# EAGLE design ReceiverV2 (EAGLE 9.2.1)
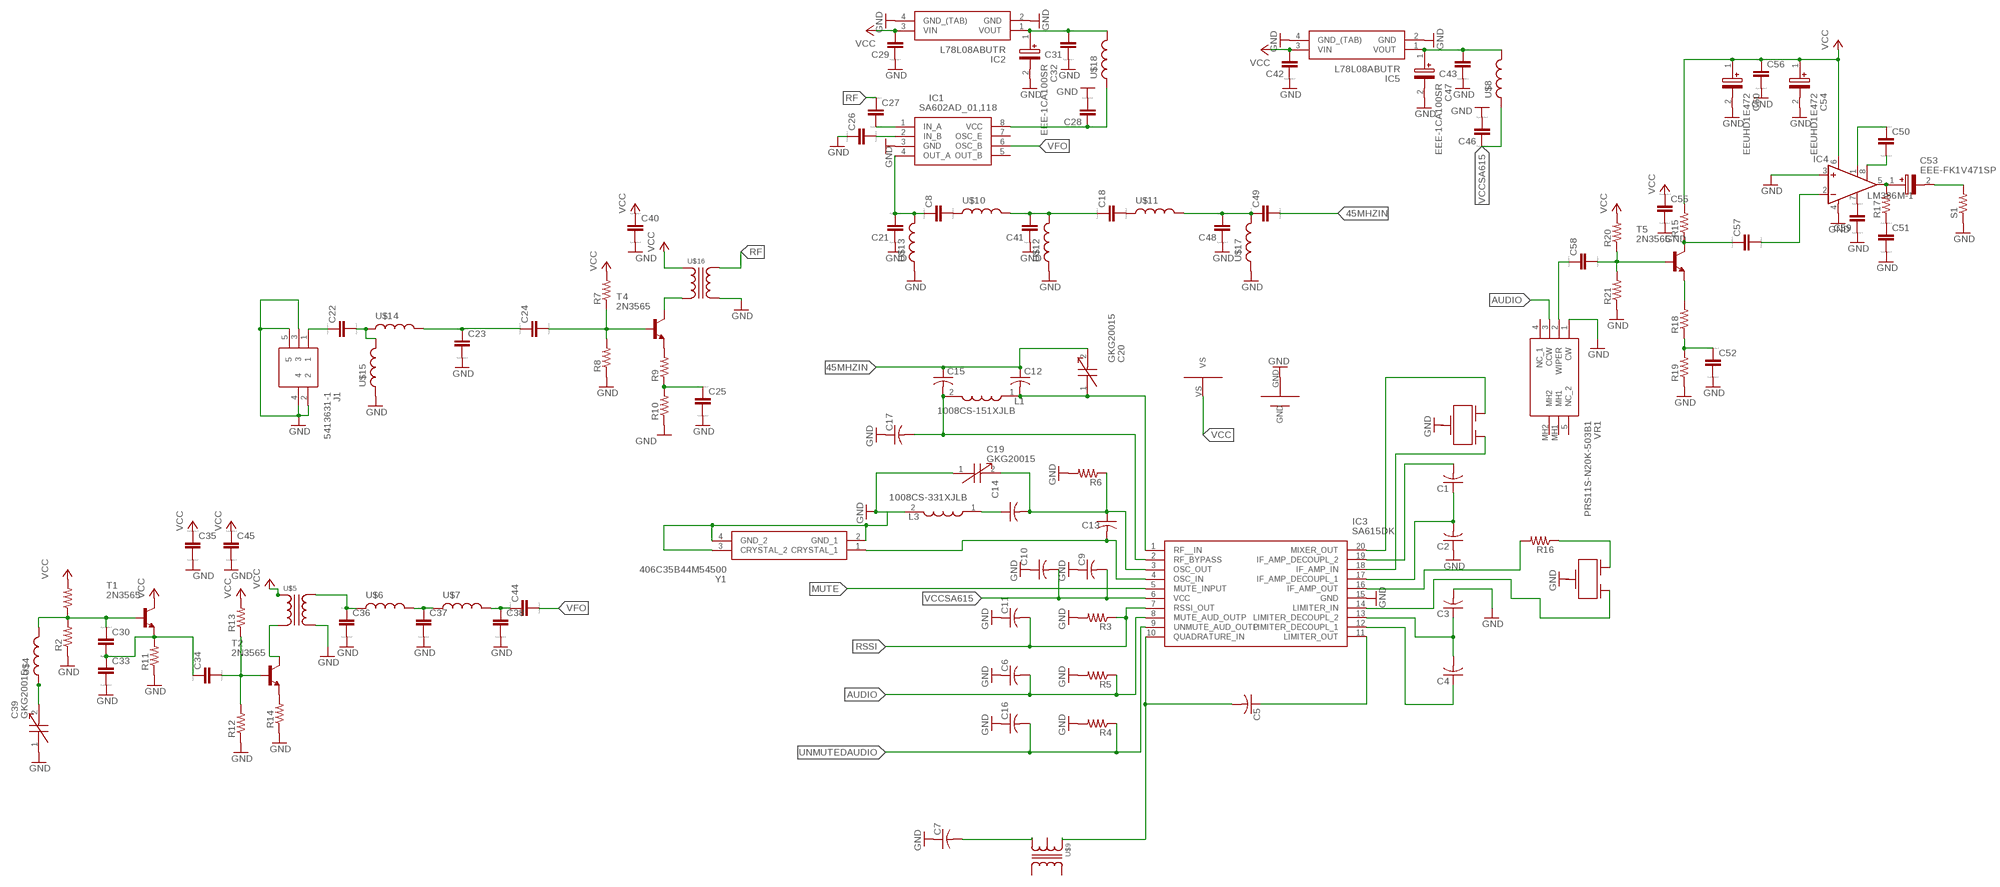
[diagram p0: schematic, sheet 1]

## Parts
C1  C-USC0805  [C0805]
C2  C-USC0805  [C0805]
C3  C-USC0805  [C0805]
C4  C-USC0805  [C0805]
C5  C-USC0805  [C0805]
C6  C-USC0805  [C0805]
C7  C-USC0805  [C0805]
C8  C  [C0805]
C9  C-USC0805  [C0805]
C10  C-USC0805  [C0805]
C11  C-USC0805  [C0805]
C12  C-USC0805  [C0805]
C13  C-USC0805  [C0805]
C14  C-USC0805  [C0805]
C15  C-USC0805  [C0805]
C16  C-USC0805  [C0805]
C17  C-USC0805  [C0805]
C18  C  [C0805]
C19  GKG20015  [GKG20015]
C20  GKG20015  [GKG20015]
C21  C  [C0805]
C22  C  [C0805]
C23  C  [C0805]
C24  C  [C0805]
C25  C  [C0805]
C26  C  [C0805]
C27  C  [C0805]
C28  C  [C0805]
C29  C  [C0805]
C30  C  [C0805]
C31  C  [C0805]
C32  EEE-1CA100SR  [SV(B)]
C33  C  [C0805]
C34  C  [C0805]
C35  C  [C0805]
C36  C  [C0805]
C37  C  [C0805]
C38  C  [C0805]
C39  GKG20015  [GKG20015]
C40  C  [C0805]
C41  C  [C0805]
C42  C  [C0805]
C43  C  [C0805]
C44  C  [C0805]
C45  C  [C0805]
C46  C  [C0805]
C47  EEE-1CA100SR  [SV(B)]
C48  C  [C0805]
C49  C  [C0805]
C50  C  [C0805]
C51  C  [C0805]
C52  C  [C0805]
C53  EEE-FK1V471SP  [CAPAE1030X1050N]
C54  EEUHD1E472  [CAPPRD750W85D1600H2700]
C55  C  [C0805]
C56  CC1206  [C1206]
C57  C  [C0805]
C58  C  [C0805]
C59  C  [C0805]
C60  EEUHD1E472  [CAPPRD750W85D1600H2700]
IC1  SA602AD_01,118  [SOIC127P600X175-8N]
IC2  L78L08ABUTR  [ST-SOT-89]
IC3  SA615DK  [SOP65P640X150-20N]
IC4  LM386M-1  [SO08]
IC5  L78L08ABUTR  [ST-SOT-89]
J1  5413631-1  [54136311]
L1  1008CS-151XJLB  [INDC2928X203N]
L3  1008CS-331XJLB  [INDC2928X203N]
R1  R-US_R0805  [R0805]
R2  R-US_R0805  [R0805]
R3  R-US_R0805  [R0805]
R4  R-US_R0805  [R0805]
R5  R-US_R0805  [R0805]
R6  R-US_R0805  [R0805]
R7  R-US_R0805  [R0805]
R8  R-US_R0805  [R0805]
R9  R-US_R0805  [R0805]
R10  R-US_R0805  [R0805]
R11  R-US_R0805  [R0805]
R12  R-US_R0805  [R0805]
R13  R-US_R0805  [R0805]
R14  R-US_R0805  [R0805]
R15  R-US_R0805  [R0805]
R16  R-US_R0805  [R0805]
R17  R-US_R0805  [R0805]
R18  R-US_R0805  [R0805]
R19  R-US_R0805  [R0805]
R20  R-US_R0805  [R0805]
R21  R-US_R0805  [R0805]
S1  R-US_0207/5V  [0207/5V]
T1  2N3565  [TO92]
T2  2N3565  [TO92]
T4  2N3565  [TO92]
T5  2N3565  [TO92]
U$1  ALLIGATORCLIPS  [ALLIGATORCONNECTOR]
U$2  CFWLB455KGFA-B0  [CFWLB455KGFA-B0]
U$4  WOUNDINDUCTOR  [WOUNDINDUCTOR]
U$5  RFTRANSFORMER  [RFTRABSFORMER]
U$6  WOUNDINDUCTOR  [WOUNDINDUCTOR]
U$7  WOUNDINDUCTOR  [WOUNDINDUCTOR]
U$8  WOUNDINDUCTOR  [WOUNDINDUCTOR]
U$9  42IF123  [42IF123]
U$10  WOUNDINDUCTOR  [WOUNDINDUCTOR]
U$11  WOUNDINDUCTOR  [WOUNDINDUCTOR]
U$12  WOUNDINDUCTOR  [WOUNDINDUCTOR]
U$13  WOUNDINDUCTOR  [WOUNDINDUCTOR]
U$14  WOUNDINDUCTOR  [WOUNDINDUCTOR]
U$15  WOUNDINDUCTOR  [WOUNDINDUCTOR]
U$16  RFTRANSFORMER  [RFTRABSFORMER]
U$17  WOUNDINDUCTOR  [WOUNDINDUCTOR]
U$18  WOUNDINDUCTOR  [WOUNDINDUCTOR]
U$19  CFWLB455KGFA-B0  [CFWLB455KGFA-B0]
VR1  PRS11S-N20K-503B1  [PRS11SN20K503B1]
Y1  406C35B44M54500  [406C35B44M54500]

## Nets
45MHZIN: C12.1 C15.1 C20.2 C49.2
AUDIO: C6.2 IC3.8(MUTE_AUD_OUTP) R5.1 VR1.3(CCW)
GND: C2.1 C3.2 C6.1 C7.1 C9.1 C10.1 C11.1 C16.1 C17.1 C19.1 C21.1 C23.2 C25.2 C26.1 C28.2 C29.1 C31.1 C32.2(-) C33.2 C35.2 C36.2 C37.2 C38.2 C39.1 C40.2 C41.1 C42.1 C43.1 C45.2 C46.2 C47.2(-) C48.1 C51.2 C52.2 C54.2(-) C55.2 C56.2 C59.1 C60.2(-) IC1.3(GND) IC2.2(GND) IC2.4(GND_(TAB)) IC3.15(GND) IC4.3(+IN) IC4.4(GND) IC5.2(GND) IC5.4(GND_(TAB)) J1.2 J1.3 J1.4 J1.5 L3.2 R2.1 R3.2 R4.2 R5.2 R6.2 R8.1 R10.1 R11.1 R12.1 R14.1 R19.1 R21.1 S1.1 U$1.GND U$5.P$4 U$12.1 U$13.1 U$15.1 U$16.P$4 U$17.1 VR1.1(CW) Y1.2(GND_1) Y1.3(CRYSTAL_2) Y1.4(GND_2)
MUTE: IC3.5(MUTE_INPUT)
N$1: C25.1 R9.1 R10.2
N$2: C22.1 J1.1
N$3: C23.1 C24.1 U$14.2
N$5: C5.2 IC3.10(QUADRATURE_IN) U$9.P$2
N$6: C14.1 L3.1
N$7: C5.1 IC3.11(LIMITER_OUT)
N$8: C4.1 IC3.12(LIMITER_DECOUPL_1)
N$9: C3.1 C4.2 IC3.13(LIMITER_DECOUPL_2)
N$10: C7.2 U$9.P$3
N$11: IC3.14(LIMITER_IN) U$2.P$4(OUT)
N$12 [Small]: C15.2 C17.2 IC3.2(RF_BYPASS) L1.2
N$13: C13.2 IC3.4(OSC_IN) Y1.1(CRYSTAL_1)
N$14 [Small]: C13.1 C14.2 C19.2 IC3.3(OSC_OUT) R6.1
N$15: IC3.16(IF_AMP_OUT) R16.2
N$16 [Small]: C12.2 C20.1 IC3.1(RF__IN) L1.1
N$17: C57.2 IC4.2(-IN)
N$18: C1.1 C2.2 IC3.17(IF_AMP_DECOUPL_1)
N$19: IC3.18(IF_AMP_IN) U$19.P$4(OUT)
N$20: IC3.20(MIXER_OUT) U$19.P$1(IN)
N$21: C1.2 IC3.19(IF_AMP_DECOUPL_2)
N$22: C24.2 R7.1 R8.2 T4.2(B)
N$23: R9.2 T4.3(E)
N$24: T4.1(C) U$16.P$1
N$25: C26.2 IC1.2(IN_B)
N$26: C27.2 IC1.1(IN_A)
N$27: C8.2 U$10.1
N$28: C8.1 C21.2 IC1.4(OUT_A) U$13.2
N$29: R14.2 T2.3(E)
N$30: C30.2 C33.1 C34.1 R11.2 T1.3(E)
N$31: C30.1 R1.1 R2.2 T1.2(B) U$4.2
N$32: C34.2 R12.2 R13.1 T2.2(B)
N$33: C39.2 U$4.1
N$34: C28.1 IC1.8(VCC) U$18.1
N$35: C36.1 U$5.P$3 U$6.1
N$36: C22.2 U$14.1 U$15.2
N$37: C37.1 U$6.2 U$7.1
N$38: C38.1 C44.1 U$7.2
N$39: T2.1(C) U$5.P$1
N$40: C18.2 U$11.1
N$41: C18.1 C41.2 U$10.2 U$12.2
N$42: C43.2 C47.1(+) IC5.1(VOUT) U$8.2
N$43: C48.2 C49.1 U$11.2 U$17.2
N$44: C58.1 VR1.2(WIPER)
N$45: C53.1(+) IC4.5(OUT) R17.2
N$46: C51.1 R17.1
N$47: C31.2 C32.1(+) IC2.1(VOUT) U$18.2
N$48: C50.1 IC4.1(GAIN)
N$49: C50.2 IC4.8(GAIN)
N$50: C53.2(-) S1.2
N$51: C58.2 R20.1 R21.2 T5.2(B)
N$52: R18.2 T5.3(E)
N$53: C52.1 R18.1 R19.2
N$54: C57.1 R15.1 T5.1(C)
N$55: C59.2 IC4.7(BYPASS)
N$56: R16.1 U$2.P$1(IN)
RF: C27.1 U$16.P$3
RSSI [Small]: C11.2 IC3.7(RSSI_OUT) R3.1
UNMUTEDAUDIO: C16.2 IC3.9(UNMUTE_AUD_OUTP) R4.1
VCC: C29.2 C35.1 C40.1 C42.2 C45.1 C54.1(+) C55.1 C56.1 C60.1(+) IC2.3(VIN) IC4.6(VS) IC5.3(VIN) R1.2 R7.2 R13.2 R15.2 R20.2 T1.1(C) U$1.VS U$5.P$2 U$16.P$2
VCCSA615: C9.2 C10.2 C46.1 IC3.6(VCC) U$8.1
VFO: C44.2 IC1.6(OSC_B)
Unconnected: IC1.5(OUT_B) IC1.7(OSC_E) U$2.GND U$2.P$3(GND) U$2.P$5(GND) U$9.P$1 U$9.P$4 U$9.P$5 U$19.GND U$19.P$3(GND) U$19.P$5(GND) VR1.4(NC_1) VR1.5(NC_2) VR1.MH1 VR1.MH2

## Library data of the parts
C1-C7 C9-C17 = resistor:C-US: CAPACITOR, American symbol
C8 C18 C21-C31 C33-C38 C40-C46 C48-C52 C55-C59 = eagle-ltspice:C: CAPACITOR, European symbol; SPICEMODEL: NONE; SPICEPREFIX: C
C19 C20 C39 = SamacSys_Parts:GKG20015: Trimmer / Variable Capacitors 5-20pF 100V 85 DEG Source: Datasheet <http://www.mouser.com/datasheet/2/384/659305J-1204018.pdf>; DESCRIPTION: Trimmer / Variable Capacitors 5-20pF 100V 85 DEG; HEIGHT: 5.1mm; MANUFACTURER_NAME: Sprague Goodman; MANUFACTURER_PART_NUMBER: GKG20015; MOUSER_PART_NUMBER: 659-GKG20015; MOUSER_PRICE-STOCK: https://www.mouser.com/Search/Refine.aspx?Keyword=659-GKG20015
C32 C47 = SamacSys_Parts:EEE-1CA100SR: Aluminum Electrolytic Capacitors - SMD 10uF 16V Source: Datasheet <https://componentsearchengine.com/Datasheets/1/EEE-1CA100SR.pdf>; DESCRIPTION: Aluminum Electrolytic Capacitors - SMD 10uF 16V; HEIGHT: mm; MANUFACTURER_NAME: Panasonic; MANUFACTURER_PART_NUMBER: EEE-1CA100SR; MOUSER_PART_NUMBER: 667-EEE-1CA100SR; MOUSER_PRICE-STOCK: https://www.mouser.com/Search/Refine.aspx?Keyword=667-EEE-1CA100SR
C53 = SamacSys_Parts:EEE-FK1V471SP: Aluminum Electrolytic Capacitors - SMD 35volts 470uF SMD AEC-Q200 Reflow Only Source: Datasheet <https://industrial.panasonic.com/cdbs/www-data/pdf/RDE0000/ABA0000C1251.pdf>; DESCRIPTION: Aluminum Electrolytic Capacitors - SMD 35volts 470uF SMD AEC-Q200 Reflow Only; HEIGHT: 10.5mm; MANUFACTURER_NAME: Panasonic; MANUFACTURER_PART_NUMBER: EEE-FK1V471SP; MOUSER_PART_NUMBER: 667-EEE-FK1V471SP; MOUSER_PRICE-STOCK: https://www.mouser.com/Search/Refine.aspx?Keyword=667-EEE-FK1V471SP
C54 C60 = SamacSys_Parts:EEUHD1E472: Panasonic 4700uF 25 V dc Aluminium Electrolytic Capacitor, HD RADIAL Series 2000h 16 Dia. x 25mm Source: Datasheet <https://industrial.panasonic.com/cdbs/www-data/pdf/RDF0000/ABA0000C1035.pdf>; DESCRIPTION: Panasonic 4700uF 25 V dc Aluminium Electrolytic Capacitor, HD RADIAL Series 2000h 16 Dia. x 25mm; HEIGHT: 27mm; MANUFACTURER_NAME: Panasonic; MANUFACTURER_PART_NUMBER: EEUHD1E472
IC1 = SamacSys_Parts:SA602AD_01,118: NXP - SA602AD/01,118 - DOUBLE-BALANCED MIXER, 500MHZ, SOIC-8 Source: Datasheet <https://www.mouser.com/datasheet/2/302/SA602A-1127653.pdf>; DESCRIPTION: NXP - SA602AD/01,118 - DOUBLE-BALANCED MIXER, 500MHZ, SOIC-8; HEIGHT: 1.75mm; MANUFACTURER_NAME: NXP; MANUFACTURER_PART_NUMBER: SA602AD/01,118; MOUSER_PART_NUMBER: 771-SA602AD/01-T
IC2 IC5 = SamacSys_Parts:L78L08ABUTR: L78L08ABUTR, Voltage Regulator, 0.1A 8 V, 4-Pin SOT-89 Source: Datasheet <https://componentsearchengine.com/Datasheets/1/L78L08ABUTR.pdf>; DESCRIPTION: L78L08ABUTR, Voltage Regulator, 0.1A 8 V, 4-Pin SOT-89; HEIGHT: mm; MANUFACTURER_NAME: STMicroelectronics; MANUFACTURER_PART_NUMBER: L78L08ABUTR; MOUSER_PART_NUMBER: 511-L78L08ABU; MOUSER_PRICE-STOCK: https://www.mouser.com/Search/Refine.aspx?Keyword=511-L78L08ABU
IC3 = SamacSys_Parts:SA615DK: Up-Down Converters High performance low power mixer FM IF system Source: Datasheet <https://www.nxp.com/docs/en/data-sheet/SA615.pdf?>; DESCRIPTION: Up-Down Converters High performance low power mixer FM IF system; HEIGHT: 1.5mm; MANUFACTURER_NAME: Nexperia; MANUFACTURER_PART_NUMBER: SA615DK; MOUSER_PART_NUMBER: N/A; MOUSER_PRICE-STOCK: https://www.mouser.com/Search/Refine.aspx?Keyword=N%2FA
IC4 = linear:LM386?-*: Low Voltage Audio Power Amplifier Source: http://cache.national.com/ds/LM/LM386.pdf
J1 = SamacSys_Parts:5413631-1: TE Connectivity Right Angle 50 Through Hole BNC Connector, jack, Nickel, Solder Termination Source: Datasheet <https://componentsearchengine.com/Datasheets/1/5413631-1.pdf>; DESCRIPTION: TE Connectivity Right Angle 50 Through Hole BNC Connector, jack, Nickel, Solder Termination; HEIGHT: 11.15mm; MANUFACTURER_NAME: TE Connectivity; MANUFACTURER_PART_NUMBER: 5413631-1; MOUSER_PART_NUMBER: 571-5413631-1; MOUSER_PRICE-STOCK: https://www.mouser.com/Search/Refine.aspx?Keyword=571-5413631-1
L1 = SamacSys_Parts:1008CS-151XJLB: Fixed Inductors 1008CS AEC-Q200 150 nH 5 % 0.58 A Source: Datasheet <https://componentsearchengine.com/Datasheets/1/1008CS-151XJLB.pdf>; DESCRIPTION: Fixed Inductors 1008CS AEC-Q200 150 nH 5 % 0.58 A; HEIGHT: 2.03mm; MANUFACTURER_NAME: COILCRAFT; MANUFACTURER_PART_NUMBER: 1008CS-151XJLB; MOUSER_PART_NUMBER: 994-1008CS-151XJLB; MOUSER_PRICE-STOCK: https://www.mouser.com/Search/Refine.aspx?Keyword=994-1008CS-151XJLB
L3 = SamacSys_Parts:1008CS-331XJLB: Fixed Inductors 1008CS AEC-Q200 330 nH 5 % 0.45 A Source: Datasheet <https://componentsearchengine.com/Datasheets/1/1008CS-331XJLB.pdf>; DESCRIPTION: Fixed Inductors 1008CS AEC-Q200 330 nH 5 % 0.45 A; HEIGHT: 2.03mm; MANUFACTURER_NAME: COILCRAFT; MANUFACTURER_PART_NUMBER: 1008CS-331XJLB; MOUSER_PART_NUMBER: 994-1008CS-331XJLB; MOUSER_PRICE-STOCK: https://www.mouser.com/Search/Refine.aspx?Keyword=994-1008CS-331XJLB
R1 R2 R7-R21 = resistor:R-US_: RESISTOR, American symbol
R3-R6 S1 = rcl:R-US_: RESISTOR, American symbol; SPICEPREFIX: R
T1 T2 T4 T5 = transistor:2N3565: NPN TRANSISTOR
U$1 = Custom:ALLIGATORCLIPS
U$2 U$19 = Custom:CFWLB455KGFA-B0
U$4 U$6-U$8 U$10-U$15 U$17 U$18 = Custom:WOUNDINDUCTOR
U$5 U$16 = Custom:RFTRANSFORMER
U$9 = Custom:42IF123
VR1 = SamacSys_Parts:PRS11S-N20K-503B1: Res Carbon Film POT 50K Ohm 20% 0.05W(1/20W) 1(Elec)/1(Mech)Turn 6mm (11.7 X 18.5 X 21.4mm) Gull Wing SMD Tube Source: Datasheet <https://componentsearchengine.com/Datasheets/1/PRS11S-N20K-503B1.pdf>; DESCRIPTION: Res Carbon Film POT 50K Ohm 20% 0.05W(1/20W) 1(Elec)/1(Mech)Turn 6mm (11.7 X 18.5 X 21.4mm) Gull Wing SMD Tube; HEIGHT: 20mm; MANUFACTURER_NAME: Bourns; MANUFACTURER_PART_NUMBER: PRS11S-N20K-503B1; MOUSER_PART_NUMBER: 652-PRS11SN20K503B1; MOUSER_PRICE-STOCK: https://www.mouser.com/Search/Refine.aspx?Keyword=652-PRS11SN20K503B1
Y1 = SamacSys_Parts:406C35B44M54500: Crystals 44.545 MHZ Source: Datasheet <https://componentsearchengine.com/Datasheets/1/406C35B44M54500.pdf>; DESCRIPTION: Crystals 44.545 MHZ; HEIGHT: 1.2mm; MANUFACTURER_NAME: CTS; MANUFACTURER_PART_NUMBER: 406C35B44M54500; MOUSER_PART_NUMBER: 774-406C35B44M5; MOUSER_PRICE-STOCK: https://www.mouser.com/Search/Refine.aspx?Keyword=774-406C35B44M5

## Net classes
0 default: width 0.381 mm
2 Small: width 0.457 mm

## Board
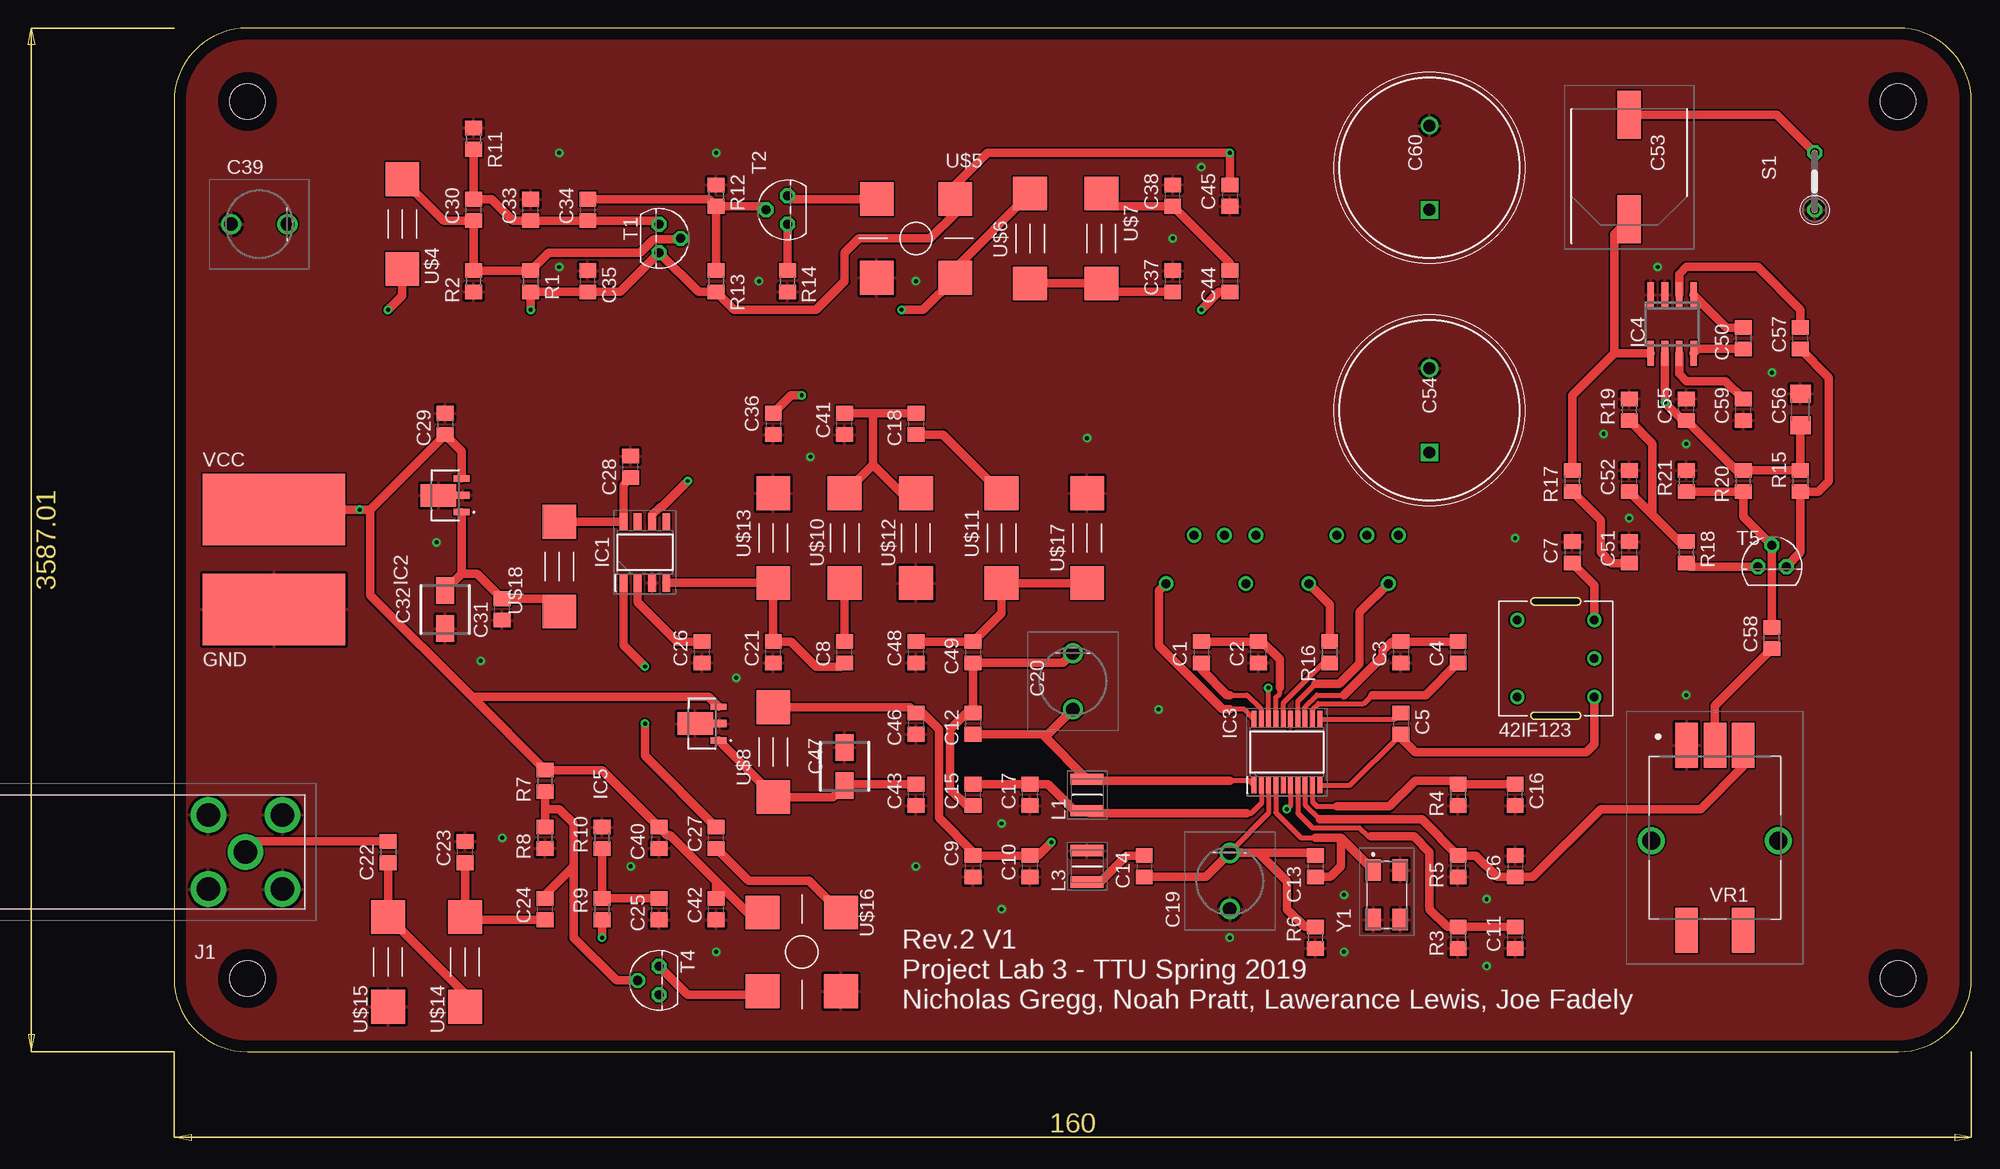
[diagram p1: board, top side]
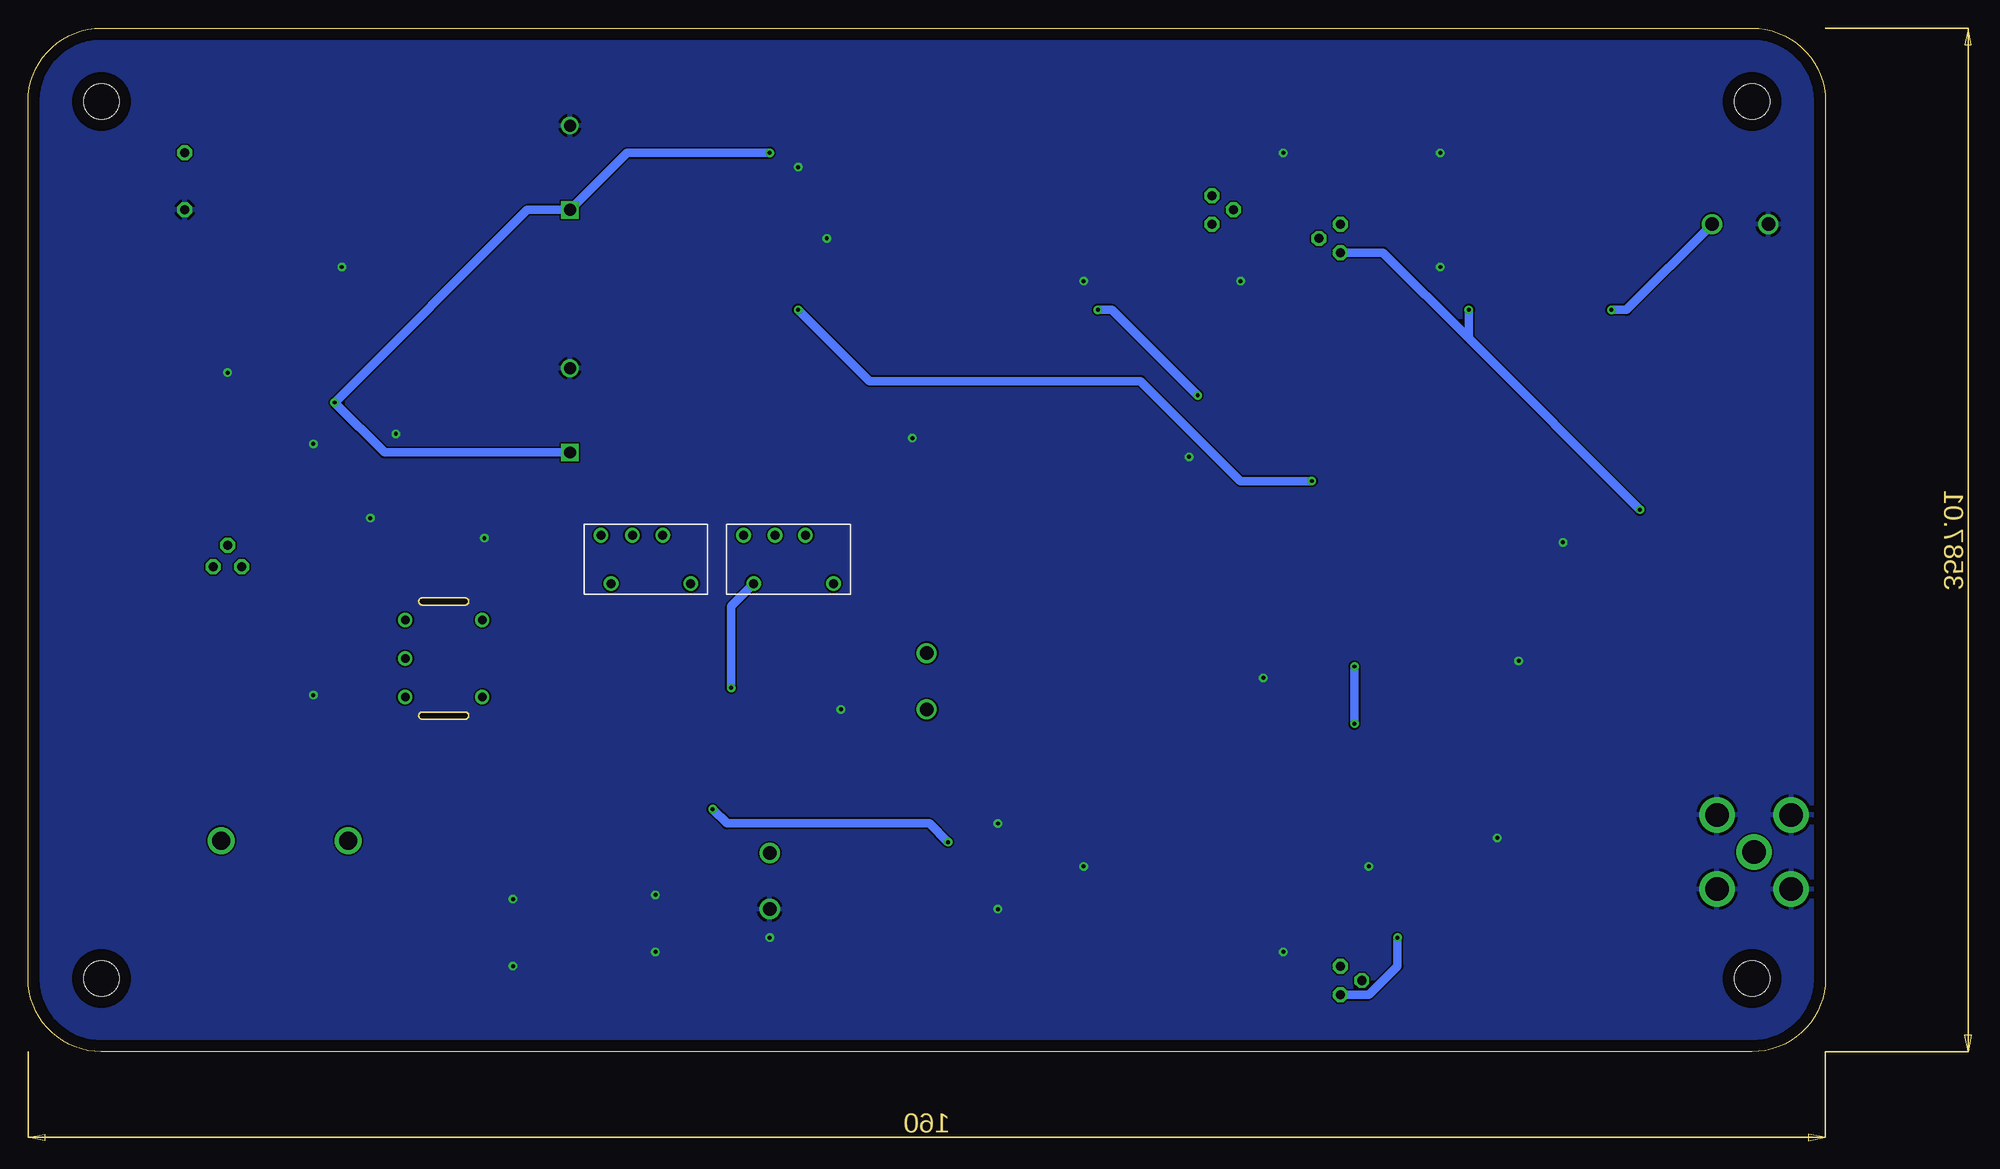
[diagram p2: board, bottom side, seen from below]

Size 160 x 91.11 mm. Coordinates in mm from the lower left corner, seen from the top.
Outline: 0,84.58 0,6.53 arc90 6.53,0 153.47,0 arc90 160,6.53 160,84.58 arc90 153.47,91.11 6.53,91.11 arc90 0,84.58
Copper layers (1*16): Top 0.035mm / dielectric 1.5mm / Bottom 0.035mm
Design rules "default": minimum track width 6mil, minimum drill 0.35mm, track to track 6mil, track to pad 6mil, pad to pad 6mil, via to via 6mil, smd to smd 6mil, copper to edge 40mil, drill to drill 6mil, minimum pad ring 10mil, minimum via ring 8mil, stop-mask expansion 4mil, vias tented up to drill 0mil, thermal gap 10mil
Holes 3.17 mm at 6.53,84.58 6.53,6.53 153.47,6.53 153.47,84.58

### Footprints (pad centres in the part's own frame; a part is rotated, then mirrored left to right if it is on the bottom)
C0805 = smd 1.3 x 1.5: 1 -0.95,0; 2 0.95,0
GKG20015 = drill 1.2 pad 1.8: 1 0,0; 2 5,0
SV(B) = smd 2.35 x 1.6: 1 -1.7,0; 2 1.7,0
CAPAE1030X1050N = smd 4.3 x 2.1: 1 -4.65,0; 2 4.65,0
CAPPRD750W85D1600H2700 = drill 1.05 pad 1.575 square: 1 0,0 | drill 1.05 pad 1.575: 2 7.5,0
C1206 = smd 1.6 x 1.8: 1 -1.4,0; 2 1.4,0
SOIC127P600X175-8N = smd 1.55 x 0.7: 1 -2.725,1.905; 2 -2.725,0.635; 3 -2.725,-0.635; 4 -2.725,-1.905; 5 2.725,-1.905; 6 2.725,-0.635; 7 2.725,0.635; 8 2.725,1.905
ST-SOT-89 = smd 0.57 x 1.4: 1 -1.5,-1.475; 3 1.5,-1.475 | smd 0.65 x 1.2: 2 0,-1.575 | smd 2 x 3.15: 4 0,0.6
SOP65P640X150-20N = smd 1.475 x 0.45: 1 -2.938,2.925; 2 -2.938,2.275; 3 -2.938,1.625; 4 -2.938,0.975; 5 -2.938,0.325; 6 -2.938,-0.325; 7 -2.938,-0.975; 8 -2.938,-1.625; 9 -2.938,-2.275; 10 -2.938,-2.925; 11 2.938,-2.925; 12 2.938,-2.275; 13 2.938,-1.625; 14 2.938,-0.975; 15 2.938,-0.325; 16 2.938,0.325; 17 2.938,0.975; 18 2.938,1.625; 19 2.938,2.275; 20 2.938,2.925
SO08 = smd 0.6 x 2.2: 1 -1.905,-2.6; 2 -0.635,-2.6; 3 0.635,-2.6; 4 1.905,-2.6; 5 1.905,2.6; 6 0.635,2.6; 7 -0.635,2.6; 8 -1.905,2.6
54136311 = drill 2.11 pad 3.165: 1 0,0; 2 -3.3,3.3; 3 -3.3,-3.3; 4 3.3,-3.3; 5 3.3,3.3
INDC2928X203N = smd 1 x 2.95: 1 -1.4,0; 2 1.4,0
R0805 = smd 1.3 x 1.5: 1 -0.95,0; 2 0.95,0
0207/5V = drill 0.813 octagon: 1 -2.54,0; 2 2.54,0
TO92 = drill 0.813 octagon: 1 1.27,0; 2 0,1.905; 3 -1.27,0
ALLIGATORCONNECTOR = smd 6.35 x 12.7: GND 7.62,2.54; VS -1.27,2.54
CFWLB455KGFA-B0 = drill 0.8: GND 6.985,1.016; P$1 9.485,5.316; P$3 4.285,1.016; P$4 2.385,5.316; P$5 1.485,1.016
WOUNDINDUCTOR = smd 3 x 3: 1 0,4; 2 0,-4
RFTRABSFORMER = smd 3 x 3: P$1 -3.5,3.5; P$2 3.5,3.5; P$3 3.5,-3.5; P$4 -3.5,-3.5
42IF123 = drill 0.762: P$1 -3.429,0; P$2 -3.429,3.429; P$3 -3.429,-3.429; P$4 3.429,3.429; P$5 3.429,-3.429
PRS11SN20K503B1 = smd 2 x 4: 1 2.5,-8.25; 2 0,-8.25; 3 -2.5,-8.25; 4 -2.5,8.25; 5 2.5,8.25 | drill 1.6 pad 2.4: MH1 -5.65,0.25; MH2 5.65,0.25
406C35B44M54500 = smd 1.9 x 1.4: 1 -2.2,-1.2; 2 2.2,-1.2; 3 2.2,1.2; 4 -2.2,1.2

### Placement (x,y rotation side)
C1  91.44,35.56 270 top
C2  96.52,35.56 90 top
C3  109.22,35.56 270 top
C4  114.3,35.56 90 top
C5  109.22,29.21 270 top
C6  119.38,16.51 270 top
C7  124.46,44.45 270 top
C8  59.69,35.56 90 top
C9  71.12,16.51 90 top
C10  76.2,16.51 90 top
C11  119.38,10.16 90 top
C12  71.12,29.21 270 top
C13  101.6,16.51 270 top
C14  86.36,16.51 270 top
C15  71.12,22.86 90 top
C16  119.38,22.86 90 top
C17  76.2,22.86 90 top
C18  66.04,55.88 270 top
C19  93.98,12.7 90 top
C20  80.01,30.48 90 top
C21  53.34,35.56 90 top
C22  19.05,17.78 270 top
C23  25.9,17.78 90 top
C24  33.02,12.7 90 top
C25  43.18,12.7 270 top
C26  46.99,35.56 90 top
C27  48.26,19.05 90 top
C28  40.64,52.07 90 top
C29  24.13,55.88 270 top
C30  26.67,74.93 90 top
C31  29.21,39.37 90 top
C32  24.13,39.37 270 top
C33  31.75,74.93 90 top
C34  36.83,74.93 90 top
C35  36.83,68.58 90 top
C36  53.34,55.88 270 top
C37  88.9,68.58 90 top
C38  88.9,76.2 90 top
C39  5.08,73.66 0 top
C40  43.18,19.05 270 top
C41  59.69,55.88 90 top
C42  48.26,12.7 90 top
C43  66.04,22.86 90 top
C44  93.98,68.58 270 top
C45  93.98,76.2 270 top
C46  66.04,29.21 270 top
C47  59.69,25.4 90 top
C48  66.04,35.56 90 top
C49  71.12,35.56 270 top
C50  139.7,63.5 270 top
C51  129.54,44.45 90 top
C52  129.54,50.8 90 top
C53  129.54,78.74 90 top
C54  111.76,53.34 90 top
C55  134.62,57.15 90 top
C56  144.78,57.15 90 top
C57  144.78,63.5 90 top
C58  142.24,36.83 90 top
C59  139.7,57.15 90 top
C60  111.76,74.93 90 top
IC1  41.91,44.45 90 top
IC2  24.13,49.53 90 top
IC3  99.06,26.67 90 top
IC4  133.35,64.77 180 top
IC5  46.99,29.21 90 top
J1  6.35,17.78 0 top
L1  81.28,22.86 270 top
L3  81.28,16.51 90 top
R1  31.75,68.58 270 top
R2  26.67,68.58 90 top
R3  114.3,10.16 270 top
R4  114.3,22.86 270 top
R5  114.3,16.51 270 top
R6  101.6,10.16 270 top
R7  33.02,24.13 90 top
R8  33.02,19.05 90 top
R9  38.1,12.7 270 top
R10  38.1,19.05 270 top
R11  26.67,81.28 270 top
R12  48.26,76.2 270 top
R13  48.26,68.58 270 top
R14  54.61,68.58 90 top
R15  144.78,50.8 90 top
R16  102.87,35.56 270 top
R17  124.46,50.8 90 top
R18  134.62,44.45 270 top
R19  129.54,57.15 270 top
R20  139.7,50.8 90 top
R21  134.62,50.8 270 top
S1  146.05,77.47 90 top
T1  43.18,72.39 270 top
T2  54.61,74.93 90 top
T4  43.18,6.35 90 top
T5  142.24,43.18 0 top
U$1  6.35,46.99 270 top
U$2  110.49,46.99 180 top
U$4  20.32,73.66 180 top
U$5  66.04,72.39 0 top
U$6  76.2,72.39 0 top
U$7  82.55,72.39 180 top
U$8  53.34,26.67 0 top
U$9  123,35 180 top
U$10  59.69,45.72 180 top
U$11  73.66,45.72 0 top
U$12  66.04,45.72 180 top
U$13  53.34,45.72 0 top
U$14  25.9,8 180 top
U$15  19.05,8 180 top
U$16  55.88,8.89 90 top
U$17  81.28,45.72 0 top
U$18  34.29,43.18 0 top
U$19  97.79,46.99 180 top
VR1  137.16,19.05 180 top
Y1  107.95,13.97 270 top

### Tracks (layer width: path | path; a pad name or v marks a point on that pad's centre or on a via)
45MHZIN
  Top 0.762: C20.2 79.14,34.61 C49.2 C12.1 70.55,30.16 69.09,28.7 69.09,23.37 70.61,21.84 70.68,21.91 C15.1
AUDIO
  Top 0.457: IC3.8 100.69,22 101.98,20.7 102.11,20.57
  Top 0.762: 101.98,20.7 111.06,20.7 R5.1 115.89,17.46 117.79,15.56 C6.2 120.97,15.56 127,21.59 135.89,21.59 139.66,25.36 VR1.3
GND  (via drill 0.35)
  other vias: 23.37,45.34 27.3,34.8 29.21,19.05 40.64,16.51 48.26,8.89 66.04,16.51 73.66,12.7 73.66,20.32 93.98,10.16 50.04,33.27 81.28,54.61 56.64,52.96 66.04,68.58 52.07,68.58 48.26,80.01 34.29,80.01 88.9,72.39 91.44,78.74 132.08,69.85 142.24,60.45 134.62,54.1 127.25,54.99 129.54,47.5 119.38,45.72 134.62,31.75 116.84,13.59 116.84,7.62 104.14,8.89 104.14,13.97 87.63,30.48 34.29,69.85
  pour Top: -1.27,91.44 161.29,91.44 161.29,-3.81 -1.27,-3.81
  pour Bottom: -1.27,91.44 161.29,91.44 161.29,-3.81 -1.27,-3.81
N$1
  Top 0.762: R10.2 R9.1 C25.1
N$2
  Top 0.762: J1.1 7.3,18.73 C22.1
N$3
  Top 0.762: C23.1 U$14.2 26.15,11.75 C24.1
N$5
  Top 0.457: IC3.10 104.69,23.73 109.06,28.1 C5.2
  Top 0.762: U$9.P$2 126.43,27.37 125.73,26.67 110.49,26.67 109.06,28.1
N$6
  Top 0.762: L3.1 82.42,15.11 84.77,17.46 C14.1
N$7
  Top 0.457: IC3.11 108.67,29.61 C5.1
N$8
  Top 0.457: IC3.12 101.33,30.47 101.85,30.99 105.92,30.99 106.68,31.75
  Top 0.762: 106.68,31.75 111.44,31.75 C4.1
N$9
  Top 0.457: IC3.13 100.69,30.71 101.73,31.75 104.14,31.75
  Top 0.762: 104.14,31.75 107.57,35.18 107.57,35.69 108.39,36.51 C3.1 C4.2
N$10
  Top 0.762: C7.2 126.43,41.53 U$9.P$3
N$11
  Top 0.457: IC3.14 100.03,31.2 101.6,32.77
  Top 0.762: 101.6,32.77 103.76,32.77 105.54,34.54 105.54,39.11 U$2.P$4
N$12
  Top 0.457: IC3.2 96.78,22.11 95.89,21.21 95.5,21.21
  Top 0.762: C15.2 C17.2 77.79,23.81 80.14,21.46 L1.2 81.53,21.21 95.5,21.21
N$13
  Top 0.457: IC3.4 98.08,21.3 100.33,19.05 101.6,19.05
  Top 0.762: 101.6,19.05 103.87,19.05 | 103.87,19.05 Y1.1 | 103.87,19.05 103.87,16.49 102.94,15.56 C13.2
N$14
  Top 0.457: IC3.3 97.44,21.23 93.98,17.78 C19.2
  Top 0.762: 96.52,17.7 C19.2 91.84,15.56 C14.2 | 96.52,17.7 101.36,17.7 C13.1 | 96.52,17.7 99.06,15.16 99.06,12.7 100.65,11.11 R6.1
N$15
  Top 0.457: IC3.16 98.73,31.04 102.3,34.61 R16.2
N$16
  Top 0.457: IC3.1 95.74,24.13 93.98,24.13
  Top 0.762: C12.2 77.47,28.26 | 77.47,28.26 77.79,28.26 C20.1 | 77.47,28.26 77.47,28.07 L1.1 81.41,24.13 93.98,24.13
N$17
  Top 0.762: IC4.2 133.99,69.22 134.62,69.85 140.97,69.85 144.78,66.04 C57.2
N$18
  Top 0.457: IC3.17 98.08,30.48 98.08,30.77 98.08,31.54 98.42,31.88 98.42,32.38
  Top 0.762: 98.42,32.38 98.42,34.92 96.84,36.51 C2.2 C1.1
N$19  (via drill 0.35)
  Top 0.457: IC3.18 97.44,32.36 v97.41,32.38
  Bottom 0.762: v97.41,32.38 97.41,39.67 U$19.P$4
N$20
  Top 0.457: IC3.20 95.26,30.48 93.98,30.48
  Top 0.762: 93.98,30.48 93.34,30.48 87.67,36.16 87.67,41.04 U$19.P$1
N$21
  Top 0.457: IC3.19 96.78,30.47 95.5,31.75 93.98,31.75
  Top 0.762: C1.2 91.44,34.04 93.73,31.75 93.98,31.75
N$22
  Top 0.762: R7.1 33.02,21.59 | 33.02,21.59 R8.2 | 33.02,21.59 34.29,21.59 35.56,20.32 35.56,16.51 | 35.56,16.51 33.02,13.97 C24.2 | 35.56,16.51 35.56,10.16 39.37,6.35 T4.2
N$23  (via drill 0.35)
  Top 0.762: R9.2 v38.1,10.16
  Bottom 0.762: T4.3 40.64,5.08 38.1,7.62 v38.1,10.16
N$24
  Top 0.762: U$16.P$1 52.07,5.08 45.72,5.08 T4.1
N$25
  Top 0.762: IC1.2 41.27,40.01 44.77,36.51 C26.2
N$26  (via drill 0.35)
  Top 0.762: C27.2 41.91,26.35 v41.91,29.21 | IC1.1 40.01,36.2 v41.91,34.29
  Bottom 0.762: v41.91,34.29 v41.91,29.21
N$27
  Top 0.762: U$10.1 C8.2
N$28
  Top 0.762: IC1.4 U$13.2 C21.2 54.93,36.51 57.15,34.29 59.37,34.29 C8.1
N$29
  Top 0.762: T2.3 R14.2
N$30
  Top 0.762: R11.2 C30.2 28.26,75.88 30.16,73.98 C33.1 C34.1 42.86,73.98 T1.3
N$31
  Top 0.762: U$4.2 24,73.98 C30.1 R2.2 R1.1 33.34,71.12 41.49,71.12 42.69,72.31 45.01,72.31 T1.2
N$32
  Top 0.762: C34.2 47.63,75.88 R12.2 | R12.2 52.38,75.25 T2.2 | R12.2 R13.1
N$33  (via drill 0.35)
  Top 0.762: U$4.1 20.32,67.31 v19.05,66.04
  Bottom 0.762: C39.2 17.7,66.04 v19.05,66.04
N$34
  Top 0.762: U$18.1 IC1.8 40.01,50.48 C28.1
N$35  (via drill 0.35)
  Top 0.762: C36.1 54.93,58.42 v55.88,58.42 | v64.77,66.04 66.69,66.04 U$5.P$3 69.54,69.73 U$6.1
  Bottom 0.762: v55.88,58.42 63.5,66.04 v64.77,66.04
N$36
  Top 0.762: C22.2 U$15.2 25.9,5.15 U$14.1
N$37
  Top 0.762: C37.1 83.31,67.63 U$7.1 U$6.2
N$38
  Top 0.762: C44.1 93.98,70.17 C38.1 83.69,75.25 U$7.2
N$39
  Top 0.762: T2.1 54.92,75.89 U$5.P$1
N$40
  Top 0.762: C18.2 68.45,54.93 U$11.1
N$41
  Top 0.762: C41.2 62.23,56.83 | 62.23,56.83 C18.1 | U$10.2 62.23,52.26 | 62.23,52.26 62.23,56.83 | 62.23,52.26 64.77,49.72 U$12.2
N$42
  Top 0.762: IC5.1 53.34,22.84 U$8.2 58.66,22.67 C47.1 59.8,23.81 C43.2
N$43
  Top 0.762: C48.2 C49.1 73.66,39.05 U$11.2 U$17.2
N$44
  Top 0.762: C58.1 137.16,30.8 VR1.2
N$45
  Top 0.762: R17.2 124.46,58.42 128.21,62.17 | 128.21,62.17 IC4.5 | C53.1 128.21,72.76 128.21,62.17
N$46
  Top 0.762: R17.1 127,47.31 127,44.45 127.95,43.5 C51.1
N$47
  Top 0.762: IC2.1 25.61,42.55 | 25.61,42.55 C32.1 | 25.61,42.55 26.98,42.55 C31.2 33.15,40.32 U$18.2
N$48
  Top 0.762: IC4.1 138.18,64.45 C50.1
N$49
  Top 0.762: IC4.8 135.63,62.55 C50.2
N$50
  Top 0.762: C53.2 142.67,83.39 S1.2
N$51
  Top 0.762: R21.2 R20.1 139.7,47.62 T5.2 C58.2
N$52
  Top 0.762: R18.2 134.94,43.18 T5.3
N$53
  Top 0.762: C52.1 131.6,47.78 | 131.6,47.78 133.99,45.4 R18.1 | R19.2 131.6,54.13 131.6,47.78
N$54
  Top 0.762: T5.1 144.78,44.45 R15.1 146.37,49.85 147.32,50.8 147.32,60.01 C57.1
N$55
  Top 0.762: IC4.7 133.99,60.33 134.62,59.69 138.11,59.69 C59.2
N$56
  Top 0.762: R16.1 102.87,39.81 U$2.P$1
RF
  Top 0.762: C27.1 51.12,15.24 56.53,15.24 U$16.P$3
RSSI
  Top 0.457: IC3.7 100.03,21.25 101.35,19.94 105.54,19.94 106.3,19.18 106.55,19.18
  Top 0.762: 106.55,19.18 110.36,19.18 111.76,17.78 111.76,12.7 113.35,11.11 R3.1 C11.2
UNMUTEDAUDIO
  Top 0.457: IC3.9 101.33,22.24 101.73,21.84 103.5,21.84
  Top 0.762: 103.5,21.84 108.2,21.84 110.49,24.13 113.98,24.13 R4.1 C16.2
VCC  (via drill 0.35)
  Top 0.762: U$1.VS v16.51,48.26 17.46,48.26 | 17.46,48.26 C29.2 25.61,53.45 IC2.3 | 17.46,48.26 17.46,40.64 26.51,31.59 | 26.51,31.59 R7.2 38.1,25.08 C40.1 43.9,19.28 44.15,19.28 48.26,15.17 | 26.51,31.59 47.59,31.59 IC5.3 | 48.26,15.17 51.04,12.39 U$16.P$2 | C42.2 48.26,15.17 | v31.75,66.04 R1.2 C35.1 39.69,67.63 T1.1 46.67,67.63 R13.2 49.85,66.04 57.15,66.04 59.69,68.58 59.69,71.12 60.96,72.39 67.31,72.39 69.54,74.62 U$5.P$2 69.54,77.16 72.39,80.01 v93.98,80.01 C45.1 | IC4.6 v132.72,57.78 134.3,56.2 C55.1 139.07,51.75 R20.2 R15.2 C56.1
  Bottom 0.762: v16.51,48.26 31.75,63.5 | 31.75,63.5 v31.75,66.04 | 31.75,63.5 39.37,71.12 T1.1 | C54.1 128.27,53.34 v132.72,57.78 115.57,74.93 C60.1 106.68,80.01 v93.98,80.01
VCCSA615  (via drill 0.35)
  Top 0.457: IC3.6 99.39,21.91 v99.06,21.59
  Top 0.762: U$8.1 65.53,30.67 C46.1 66.61,30.16 68.07,28.7 68.07,20.83 71.12,17.78 C9.2 C10.2 76.9,17.46 v78.11,18.67
  Bottom 0.762: v78.11,18.67 79.76,20.32 97.79,20.32 v99.06,21.59
VFO  (via drill 0.35)
  Top 0.762: v45.72,50.8 43.4,48.48 43.24,48.48 42.55,47.78 IC1.6 | v91.44,66.04 93.03,67.63 C44.2
  Bottom 0.762: v45.72,50.8 52.07,50.8 60.96,59.69 85.09,59.69 v91.44,66.04

### Text on the board
tNames: Rev.2 V1 / Project Lab 3 - TTU Spring 2019 / Nicholas Gregg, Noah Pratt, Lawerance Lewis, Joe Fadely